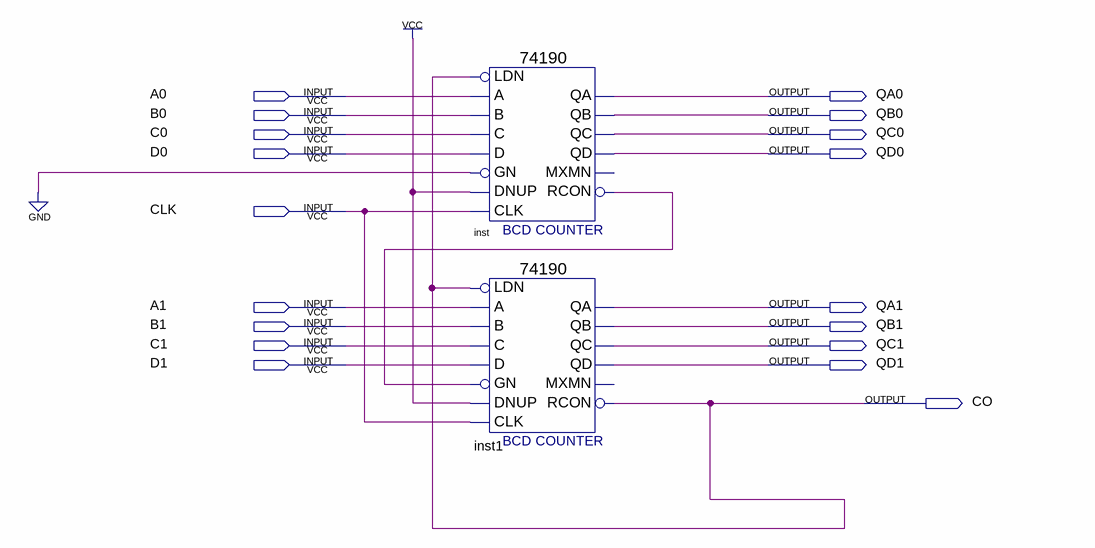
[diagram p0: schematic sheet]
// Quartus schematic Block4T.bdf as structural Verilog: 2 symbols, 18 pins
module Block4T (
  input  A0,
  input  B0,
  input  C0,
  input  D0,
  input  CLK,
  input  A1,
  input  B1,
  input  C1,
  input  D1,
  output QA0,
  output QB0,
  output QC0,
  output QD0,
  output QA1,
  output QB1,
  output QC1,
  output QD1,
  output CO
);

  wire inst_rcon;

  \74190  inst (
    .LDN(CO), .A(A0), .C(C0), .B(B0), .D(D0), .GN(1'b0), .CLK(CLK), .DNUP(1'b1), .QA(QA0), .QB(QB0),
    .QD(QD0), .QC(QC0), .RCON(inst_rcon));  // open: MXMN
  \74190  inst1 (
    .LDN(CO), .A(A1), .C(C1), .B(B1), .D(D1), .GN(inst_rcon), .CLK(CLK), .DNUP(1'b1), .QA(QA1), .QB(QB1),
    .QD(QD1), .QC(QC1), .RCON(CO));  // open: MXMN
endmodule
